# Altium schematic sheet Power.SchDoc
size A3; SheetNumber: 3; SheetTotal: 11
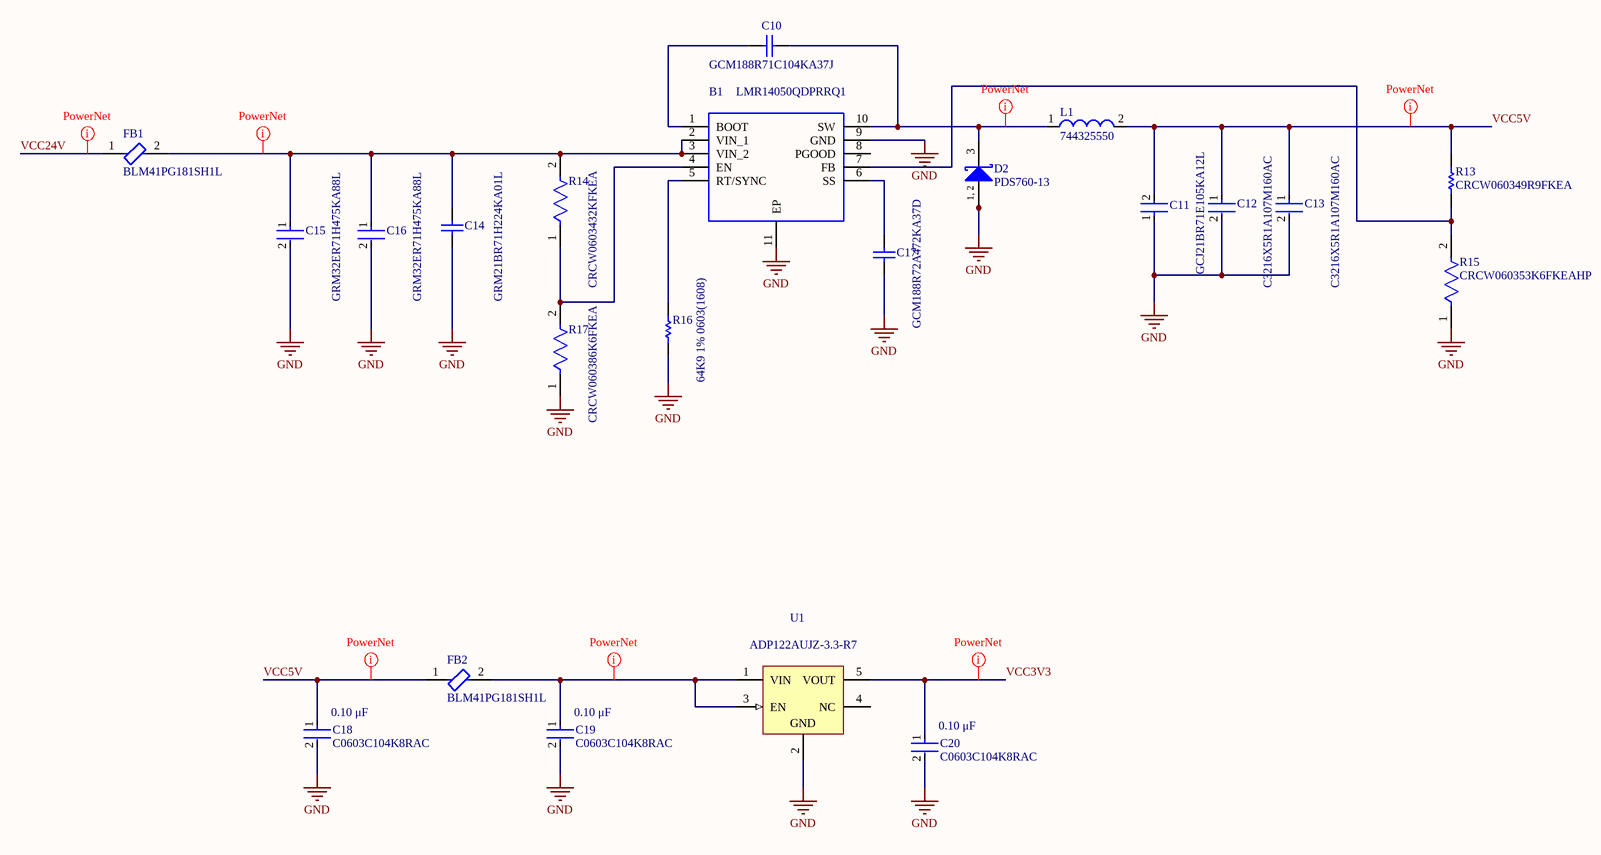
[diagram p0: Power.SchDoc]

## Parts
B1  LMR14050QDPRRQ1  [SON80P400X400X80-11N]
C10  GCM188R71C104KA37J  [CAPC1608X90X35LL10T15]
C11  GCJ21BR71E105KA12L  [FP-GCJ21B-0_3-MFG]
C12  C3216X5R1A107M160AC  [FP-C3216-160-0_3-IPC_C]
C13  C3216X5R1A107M160AC  [FP-C3216-160-0_3-IPC_C]
C14  GRM21BR71H224KA01L  [CAPC2013X135X45NL10T25]
C15  GRM32ER71H475KA88L  [FP-GRM32-MFG]
C16  GRM32ER71H475KA88L  [FP-GRM32-MFG]
C17  GCM188R72A472KA37D  [CAPC1608X90X35ML10T15]
C18  C0603C104K8RAC  Capacitance: 0.10 μF  [FP-C0603C-CF-MFG]
C19  C0603C104K8RAC  Capacitance: 0.10 μF  [FP-C0603C-CF-MFG]
C20  C0603C104K8RAC  Capacitance: 0.10 μF  [FP-C0603C-CF-MFG]
D2  PDS760-13  [DIOD-POWERDI5-3_V]
FB1  BLM41PG181SH1L  [FP-BLM41-0_2-a1_2-MFG]
FB2  BLM41PG181SH1L  [FP-BLM41-0_2-a1_2-MFG]
L1  744325550  [WE-HCI-1050]
R13  CRCW060349R9FKEA  [RESC1609X50X30ML10T20]
R14  CRCW0603432KFKEA  [FP-CRCW0603-e3-MFG]
R15  CRCW060353K6FKEAHP  [FP-CRCW0603-HPe3-MFG]
R16  64K9 1% 0603(1608)  [RESC0603(1608)_N]
R17  CRCW060386K6FKEA  [FP-CRCW0603-e3-IPC_B]
U1  ADP122AUJZ-3.3-R7  [ADI-UJ-5_M]

## Nets
GND: B1.9(GND) B1.11(EP) C11.1 C12.2 C13.2 C14.1 C15.2 C16.2 C17.1 C18.2 C19.2 C20.2 D2.1(A) D2.2(A) R15.1 R16.1 R17.1 U1.2(GND)
VCC3V3: C20.1 U1.5(VOUT)
VCC5V: C11.2 C12.1 C13.1 C18.1 FB2.1 L1.2 R13.2
VCC24V: FB1.1
NetB1_1: B1.1(BOOT) C10.1
NetB1_2: B1.2(VIN_1) B1.3(VIN_2) C14.2 C15.1 C16.1 FB1.2 R14.2
NetB1_4: B1.4(EN) R14.1 R17.2
NetB1_5: B1.5(RT/SYNC) R16.2
NetB1_6: B1.6(SS) C17.2
NetB1_7: B1.7(FB) R13.1 R15.2
NetB1_10: B1.10(SW) C10.2 D2.3(K) L1.1
NetC19_1: C19.1 FB2.2 U1.1(VIN) U1.3(EN)

Not connected (* = marked no-connect by the designer): B1 8(PGOOD); U1 4(NC)

## Layout directives
net class Power: NetB1_2, NetB1_10, NetC19_1, VCC3V3, VCC5V, VCC24V

## Notes on the sheet
- (in symbol CMP-2000-07476-1) 1, 2

## Library data of the parts
B1 = LMR14050QDPRRQ1: Automotive 40V, 5A SIMPLE SWITCHER&#174;, 2.2MHz Step-Down Regulator with 40uA IQ; Manufacturer_Name: Texas Instruments; Geometry.Height: 0.8mm; Mouser Part Number: 595-LMR14050QDPRRQ1; Mouser Price/Stock: https://www.mouser.co.uk/ProductDetail/Texas-Instruments/LMR14050QDPRRQ1?qs=osPbIpHqQ9V%2F1b1tDugQKw%3D%3D; Manufacturer_Part_Number: LMR14050QDPRRQ1; Datasheet Link: http://www.ti.com/lit/gpn/lmr14050-q1
C10 = CMP-2006-02356-1: Manufacturer: Murata; Part Number: GCM188R71C104KA37J
C11 = CMP-2007-03211-2: Multilayer Ceramic Capacitors MLCC - SMD/SMT 0805 1uF 10%, 25VDC,  X7R 15%; Voltage Rating (DC): 25V; Package Quantity: 3000; Depth: 1.25mm; Packaging: Tape and Reel; Voltage Rating: 25V; Max Operating Temperature: 125°C; Ratings: AEC-Q200; Width: 1.25mm; Min Operating Temperature: -55°C; Termination: SMD/SMT; Lead Free: Lead Free; Dielectric: X7R; Length: 2mm; Thickness: 0.057inch; Capacitance: 1uF; Tolerance: 10%; Case Code (Metric): 2012; Case/Package: 0805; Mount: Surface Mount; Features: Soft Termination; Case Code (Imperial): 0805
C12 C13 = CMP-2000-05396-3: Multilayer Ceramic Capacitors 100uF ±20% 10V X5R SMD 1206; Voltage Rating (DC): 10V; Length: 3.2mm; Mount: Surface Mount; Depth: 1.6mm; Width: 1.6mm; Package Quantity: 1; Min Operating Temperature: -55°C; Packaging: Tape and Reel; Max Operating Temperature: 85°C; Dielectric: X5R; Construction: Flat; Case Code (Imperial): 1206; Capacitance: 100uF; Thickness: 0.075inch; Radiation Hardening: No; RoHS Compliant: Yes; Series: C; Dielectric Material: Ceramic; Voltage: 10V; REACH SVHC: No SVHC; Case Code (Metric): 3216; Weight: 0.000571oz; Height: 1.6mm; Voltage Rating: 10V; Termination: SMD/SMT; Lead Free: Lead Free; Tolerance: 20%; Case/Package: 1206; Resistor Type: Ceramic
C14 = CMP-2007-03583-1: Manufacturer: Murata; Part Number: GRM21BR71H224KA01L
C15 C16 = CMP-1038-02162-3: CAP CER 4.7UF 50V X7R 1210; Manufacturer: Murata; Tolerance: 10%; Temperature Coefficient: 15%; Material: Ceramic; Lead Free: Yes; Value: 4.7uF; ComponentLink2Description: Datasheet; Capacitance: 4.7uF; Digikey Description: CAP CER 4.7UF 50V X7R 1210; Category: Cap; Automotive: No; ComponentLink2URL: https://search.murata.co.jp/Ceramy/image/img/A01X/G101/ENG/GRM32ER71H475KA88-01A.pdf; Package: GRM32; Device Class L2: Capacitors; Voltage Rating: 50V; Device Class L1: Passive Components; Mouser Description: Capacitor Capacitance tolerance: ±10% Ceramic type: X7R Construction form: 1210 Capacitance: 4.7 µF Rated voltage: 50...; Octopart: https://octopart.com/grm32er71h475ka88l-murata-196576; Temperature: -55°C to +125°C; Temperature Range Low: -55°C; Height: 2.7mm; Manufacturer Part Number: GRM32ER71H475KA88L; Temperature Characteristic: X7R; Temperature Range High: +125°C; RoHS: TRUE; Device Class L3: Ceramic Capacitors
C17 = CMP-2006-02966-1: Manufacturer: Murata; Part Number: GCM188R72A472KA37D
C18-C20 = CMP-03020-006081-2: C0603 0.10 μF X7R 30ppm/°C 10.00% 10 V; Manufacturer: KEMET; Value: 0.10 μF; Material: Ceramic; Automotive Grade: Grade 1; Voltage Rating: 10 V; Tolerance: 0.1; Automotive: Yes; Device Class L2: Capacitors; Height: 0.87mm; Temperature Range High: +125°C; Temperature Coefficient: 30ppm/°C; Temperature Range Low: -55°C; Package: C0603C-CF; Lead Free: Yes; Octopart: https://octopart.com/c0603c104k8rac-kemet-1325403; Manufacturer Part Number: C0603C104K8RAC; Temperature: -55°C to +125°C; Mouser Description: .1UF 10V 10% 0603; RoHS: TRUE; ComponentLink2URL: https://api.kemet.com/component-edge/download/datasheet/C0603C100J5GACAUTO.pdf; ComponentLink2Description: Datasheet; Temperature Characteristic: X7R; Device Class L1: Passive Components; Category: Cap; Device Class L3: Ceramic Capacitors
D2 = CMP-2000-07476-1: Schottky Barrier Rectifier, 60 V, 7 A, -65 to 150 degC, 3-Pin SMD, RoHS, Tape and Reel; Manufacturer: Diodes Inc; Max Repetitive Reverse Voltage (Vrrm): 60V; Element Configuration: CommonAnode; Max Forward Surge Current (Ifsm): 275A; Polarity: Standard; Forward Voltage: 620mV; Forward Current: 7A; Peak Reverse Current: 200uA; Case\/Package: SMD/SMT; Manufacturer URL: http://www.diodes.com/; Reverse Voltage (DC): 60V; Lead Free: LeadFree; Voltage Rating (DC): 60V; Min Operating Temperature: -65degC; Package Description: 3-Pin Surface Mount Device, Body 3.975 x 5.375 mm, Pitch 1.84 mm; Length: 4.05mm; Datasheet URL: https://www.diodes.com/assets/Datasheets/ds30477.pdf; REACH SVHC: NoSVHC; Peak Non-Repetitive Surge Current: 275A; Output Current: 7A; Contact Plating: Matte; Mounting Technology: SurfaceMount; Mount: SurfaceMount; RoHSCompliant: true; Weight: 0.003386oz; Current Rating: 7A; Max Operating Temperature: 150degC; Package Quantity: 5000; Height: 1.15mm; Average Rectified Current: 7A; Datasheet Version: Rev. 13-2, 10/2012; Number of Pins: 5; Width: 5.45mm; Packaging: TapeandReel; Radiation Hardening: No; Package Reference: POWERDI5-3
FB1 FB2 = CMP-06046-002023-1: Ferrite Bead, 1806, 180Ω @ 100MHz, 25%, 0.02Ω, 3.5A; Impedance: 180R; Number of Lines: 1; Max DC Current: 50mA; DC Resistance (DCR): 20mR; Mount: Surface Mount; Length: 4.5mm; Tolerance: 25%; Series: EMIFIL®, BLM41P; Package Quantity: 2500; Min Operating Temperature: -55°C; Max Operating Temperature: 125°C; Height: 0.071inch; Packaging: Tape and Reel; Contact Plating: Tin; Test Frequency: 100MHz; Ratings: AEC-Q200; Case Code (Metric): 4516; Termination: SMD/SMT; Case Code (Imperial): 1806; Width: 0.063inch; Max Current Rating: 3.5A; Case/Package: 1806
L1 = CMP-0226-00138-1: SMD Flat Wire High Current Inductor WE-HCI, L=5.50 µH; Inductance: 5.50 ÂµH; PackageDescription: SMD Inductor, 2-Leads, Body 10.5 x 10.2 mm; DatasheetVersion: ver 2, Jan-2008; ComponentLink2Description: Datasheet; PackageVersion: 2008; ComponentLink1Description: Manufacturer Link; PackageReference: WE-HCI-1050; ComponentLink1URL: http://www.we-online.com; ComponentLink2URL: http://www.we-online.de/katalog/media/pdf/744325550.pdf
R13 = CMP-1012-00363-2: Manufacturer: Vishay Dale; Part Number: CRCW060349R9FKEA
R14 = CMP-2000-03350-2: RES Thick Film, 432kΩ, 1%, 0.1W, 100ppm/°C, 0603; Voltage Rating: 75V; Max Power Dissipation: 100mW; Resistance: 432kR; Composition: Thick Film; Package Quantity: 10; Military Standard: Not; Number of Terminations: 2; Width: 0.033inch; Lead Free: Lead Free; Height: 0.02inch; Temperature Coefficient: 100ppm/°C; Min Operating Temperature: -55°C; Length: 1.55mm; Voltage Rating (DC): 75V; Termination: SMD/SMT; Max Operating Temperature: 155°C; Case Code (Imperial): 0603; Radiation Hardening: No; Case/Package: 0603; Packaging: Tape and Reel; Features: Automotive AEC-Q200; Case Code (Metric): 1608; Tolerance: 1%; Number of Pins: 2; Contact Plating: Tin; Weight: 7.1E-05oz; Depth: 0.85mm; Power Rating: 100mW
R15 = CMP-02407-004880-1: RES Thick Film, 53.6kΩ, 1%, 0.33W, 100ppm/°C, 0603; Max Power Dissipation: 250mW; Resistance: 53.6kR; Width: 0.033inch; Max Operating Temperature: 155°C; Case/Package: 0603; Height: 0.022inch; Temperature Coefficient: 100ppm/°C; Number of Terminations: 2; Features: Automotive AEC-Q200; Min Operating Temperature: -55°C; Contact Plating: Tin; Radiation Hardening: No; Composition: Thick Film; Length: 0.063inch; Package Quantity: 5000; Lead Free: Lead Free; Packaging: Tape and Reel; Tolerance: 1%
R16 = CMP-1012-00715-1: 64K9 0.1W 1% 0603 (1608 Metric)  SMD; Value: 64900.00 Ohm; Case-EIA: 0603; Case-Metric: 1608; Technology: SMT; Tolerance: 1 %; Power: 0.1 W
R17 = CMP-2000-03614-2: RES Thick Film, 86.6kΩ, 1%, 0.1W, 100ppm/°C, 0603; Max Power Dissipation: 100mW; Voltage Rating (DC): 75V; Resistance: 86.6kR; Features: Automotive AEC-Q200; Number of Pins: 2; Min Operating Temperature: -55°C; Series: CRCW; Tolerance: 1%; Temperature Coefficient: 100ppm/°C; Max Operating Temperature: 155°C; Package Quantity: 10; Case/Package: 0603; Resistor Type: Thick Film; Case Code (Metric): 1608; Packaging: Tape and Reel; Width: 0.033inch; Termination: SMD/SMT; Construction: Rectangular; Number of Terminations: 2; Length: 1.55mm; Military Standard: Not; Resistance Tolerance: 1%; Weight: 7.1E-05oz; Case Code (Imperial): 0603; Contact Plating: Tin; RoHS Compliant: Yes; Voltage Rating: 75V; Power Rating: 100mW; Lead Free: Lead Free; Technology: THICK FILM; Size Code: 0603; Radiation Hardening: No; Height: 0.45mm; Depth: 0.85mm
U1 = CMP-0786-00346-1: 300 mA, Low Quiescent Current, CMOS Linear Regulator, 2.3 to 5.5 V Vin, 3.3 V Vout, Industrial, 5-pin SOT23 (UJ-5), Reel; Manufacturer: Analog Devices; Vin (min) (V): 2.3; Supply Current IGND @ Small Load: 45uA; Vin (max) (V): 5.5; Iout max: 300mA; Preset Vout Values (V): 3.3; ComponentLink4Description: URL Link1; ComponentLink4URL: Product URL:http://www.analog.com/en/ADP122/productSearch.html; ComponentLink2URL: http://www.analog.com/static/imported-files/data_sheets/ADP122_123.pdf; PackageDescription: 5-Pin Thin Small Outline Transistor Package, Body 2.9 x 1.6 mm, Pitch 0.95 mm; ComponentLink1URL: http://www.analog.com/en/index.html; ComponentLink3URL: http:/www.analog.com/static/imported-files/packages/PKG_PDF/TSOT(UJ)/UJ_5.pdf; ComponentLink2Description: Datasheet; PartNumber: ADP122AUJZ-3.3-R7; Packing: Reel; ComponentLink1Description: Manufacturer URL; Code_JEDEC: MO-193-AB; PackageVersion: 100708-A, 10/2008; PackageReference: UJ-5; Mounting Technology: Surface Mount; DatasheetVersion: Rev. E; ComponentLink3Description: Package Specification